# Altium schematic sheet Voltage_BypassCapacitors.SchDoc
size 287 x 147 mm; Origin: Eagle
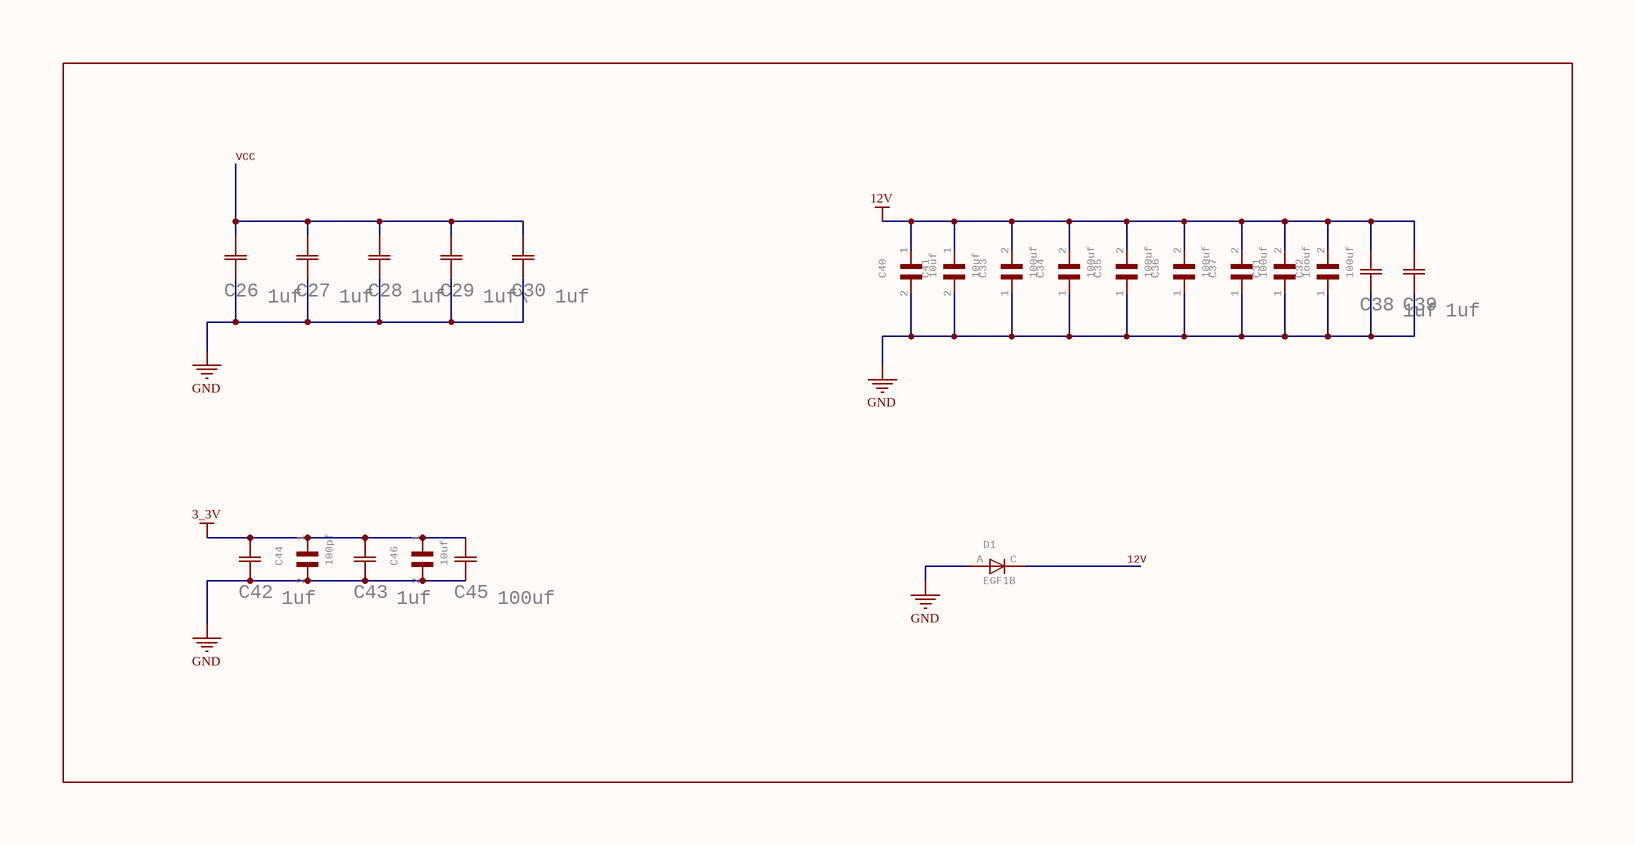
[diagram p0: Voltage_BypassCapacitors.SchDoc]

## Parts
C26  1uf  [YAG_CC0603_YAG]
C27  1uf  [YAG_CC0603_YAG]
C28  1uf  [YAG_CC0603_YAG]
C29  1uf\  [YAG_CC0603_YAG]
C30  1uf  [YAG_CC0603_YAG]
C31  1oouf  [CAPC3225X280N]
C32  100uf  [CAPC3225X280N]
C33  100uf  [CAPC3225X280N]
C34  100uf  [CAPC3225X280N]
C35  100uf  [CAPC3225X280N]
C36  100uf  [CAPC3225X280N]
C37  100uf  [CAPC3225X280N]
C38  1uf  [YAG_CC0603_YAG]
C39  1uf  [YAG_CC0603_YAG]
C40  10uf  [CAPC2012X70]
C41  10uf  [CAPC2012X70]
C42  1uf  [YAG_CC0603_YAG]
C43  1uf  [YAG_CC0603_YAG]
C44  100pf  [CAPC1608X90]
C45  100uf  [CAP_CC1210_YAG]
C46  10uf  [CAPC2012X70]
D1  EGF1B  [DIOM449X264X300L114X135N]

## Nets
3_3V: C42.2 C43.2 C44.1 C45.2 C46.1
12V: C31.2 C32.2 C33.2 C34.2 C35.2 C36.2 C37.2 C38.2 C39.2 C40.1 C41.1 D1.C
GND: C26.1 C27.1 C28.1 C29.1 C30.1 C31.1 C32.1 C33.1 C34.1 C35.1 C36.1 C37.1 C38.1 C39.1 C40.2 C41.2 C42.1 C43.1 C44.2 C45.1 C46.2 D1.A
VCC: C26.2 C27.2 C28.2 C29.2 C30.2

## Library data of the parts
C26-C30 C38 C39 C42 C43 = CC0603KRX7R7BB105: GateName_1: A; SymbolName_1: CAPH; BUILT_BY: EMA_UL_Team; SOURCELIBRARY: Yageo_2014-12-31; VENDOR: Yageo; LibraryName: Cap 1uf; DeviceSetName: CC0603KRX7R7BB105; MANUFACTURER_PART_NUMBER: CC0603KRX7R7BB105
C31-C37 = C1210C107M4PAC7800: GateName_1: G$1; MF: KEMET; SymbolName_1: C1210C107M4PAC7800; LibraryName: Cap 100uf 16v; DeviceSetName: C1210C107M4PAC7800; DIGI-KEY_PART_NUMBER: DIGI-KEY_PART_NUMBER; MP: C1210C107M4PAC7800; PACKAGE: 3225 KEMET
C40 C41 C46 = CC0805KKX5R7BB106: KC 10ÂµF 0805 10% 16V X5R; GateName_1: G$1; MF: Yageo; SymbolName_1: CC0805KKX5R7BB106; LibraryName: Cap 10uf; DeviceSetName: CC0805KKX5R7BB106; DIGI-KEY_PART_NUMBER: 311-1865-1-ND; MP: CC0805KKX5R7BB106; PACKAGE: 0805 Yageo
C44 = CC0603KRX7R7BB101: CAP CER 100PF 16V X7R 0603; GateName_1: G$1; MF: Yageo; SymbolName_1: CC0603KRX7R7BB101; LibraryName: Cap 100p; DeviceSetName: CC0603KRX7R7BB101; DIGI-KEY_PART_NUMBER: 311-4062-1-ND; MP: CC0603KRX7R7BB101; PACKAGE: 0603 Yageo
C45 = CC1210MKX5R5BB107: GateName_1: A; SymbolName_1: CAPH; BUILT_BY: EMA_Justin; SOURCELIBRARY: Add_to_database_2021-05-13; VENDOR: Yageo; LibraryName: Cap 100uf 6.3v; DeviceSetName: CC1210MKX5R5BB107; COPYRIGHT: Copyright (C) 2018 Accelerated Designs. All rights reserved; DATASHEET: https://www.mouser.com/datasheet/2/447/UPY_GP_NP0_16V_to_50V_18-1730511.pdf; MANUFACTURER_PART_NUMBER: CC1210MKX5R5BB107
D1 = EGF1B: EGF1B Series 1 A 100 V 50 ns Surface Mount Fast Recovery Rectifier - DO-214AC Check prices; GateName_1: G$1; MF: ON Semiconductor; SymbolName_1: EGF1B; LibraryName: AC214 zenzer diode replace; DeviceSetName: EGF1B; AVAILABILITY: In Stock; MP: EGF1B; PACKAGE: DO-214AC-214 ON Semiconductor; PRICE: None